# Altium schematic sheet Sheet2.SchDoc
size A2; SheetNumber: 1; SheetTotal: 1
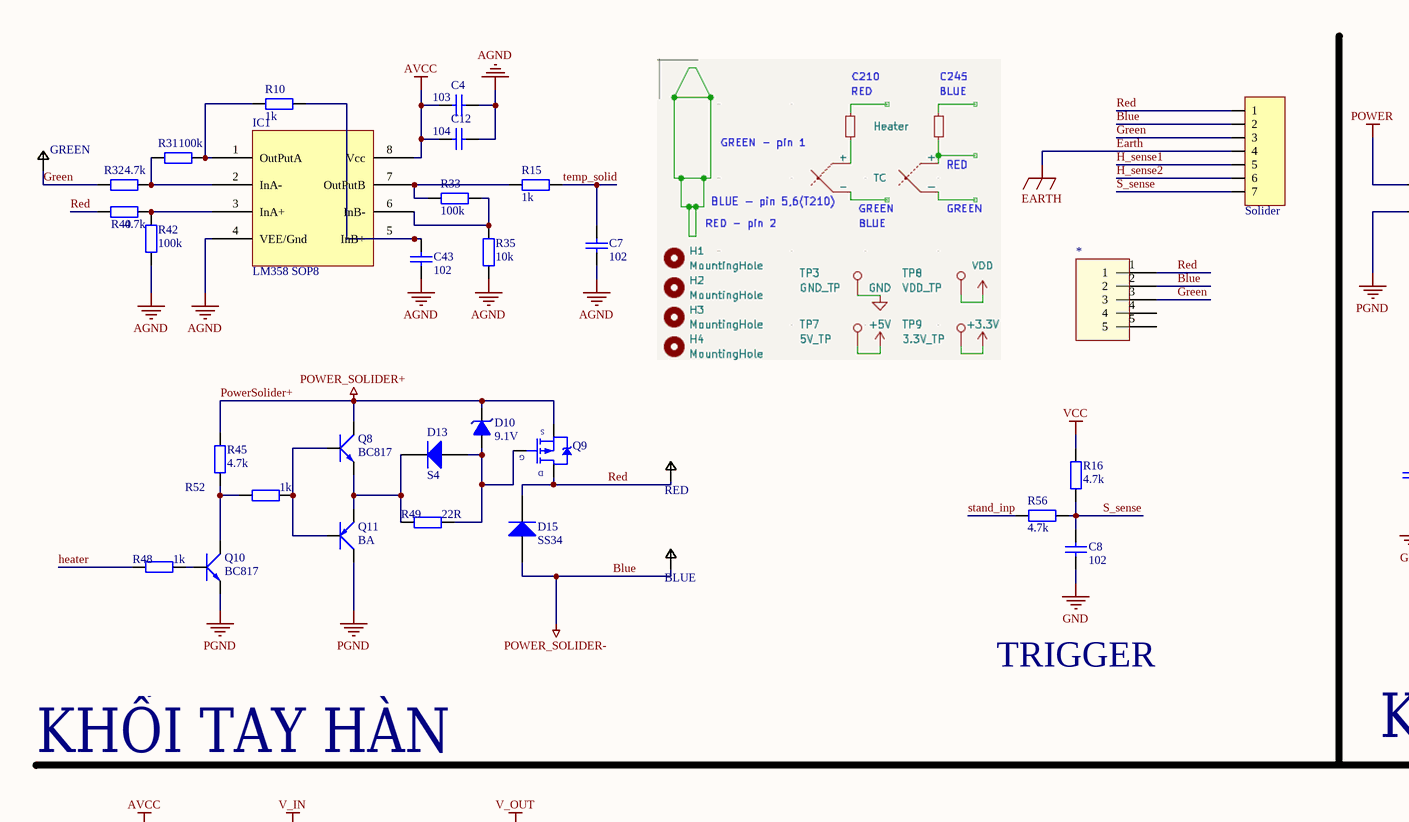
[diagram p0: Sheet2.SchDoc, top left]
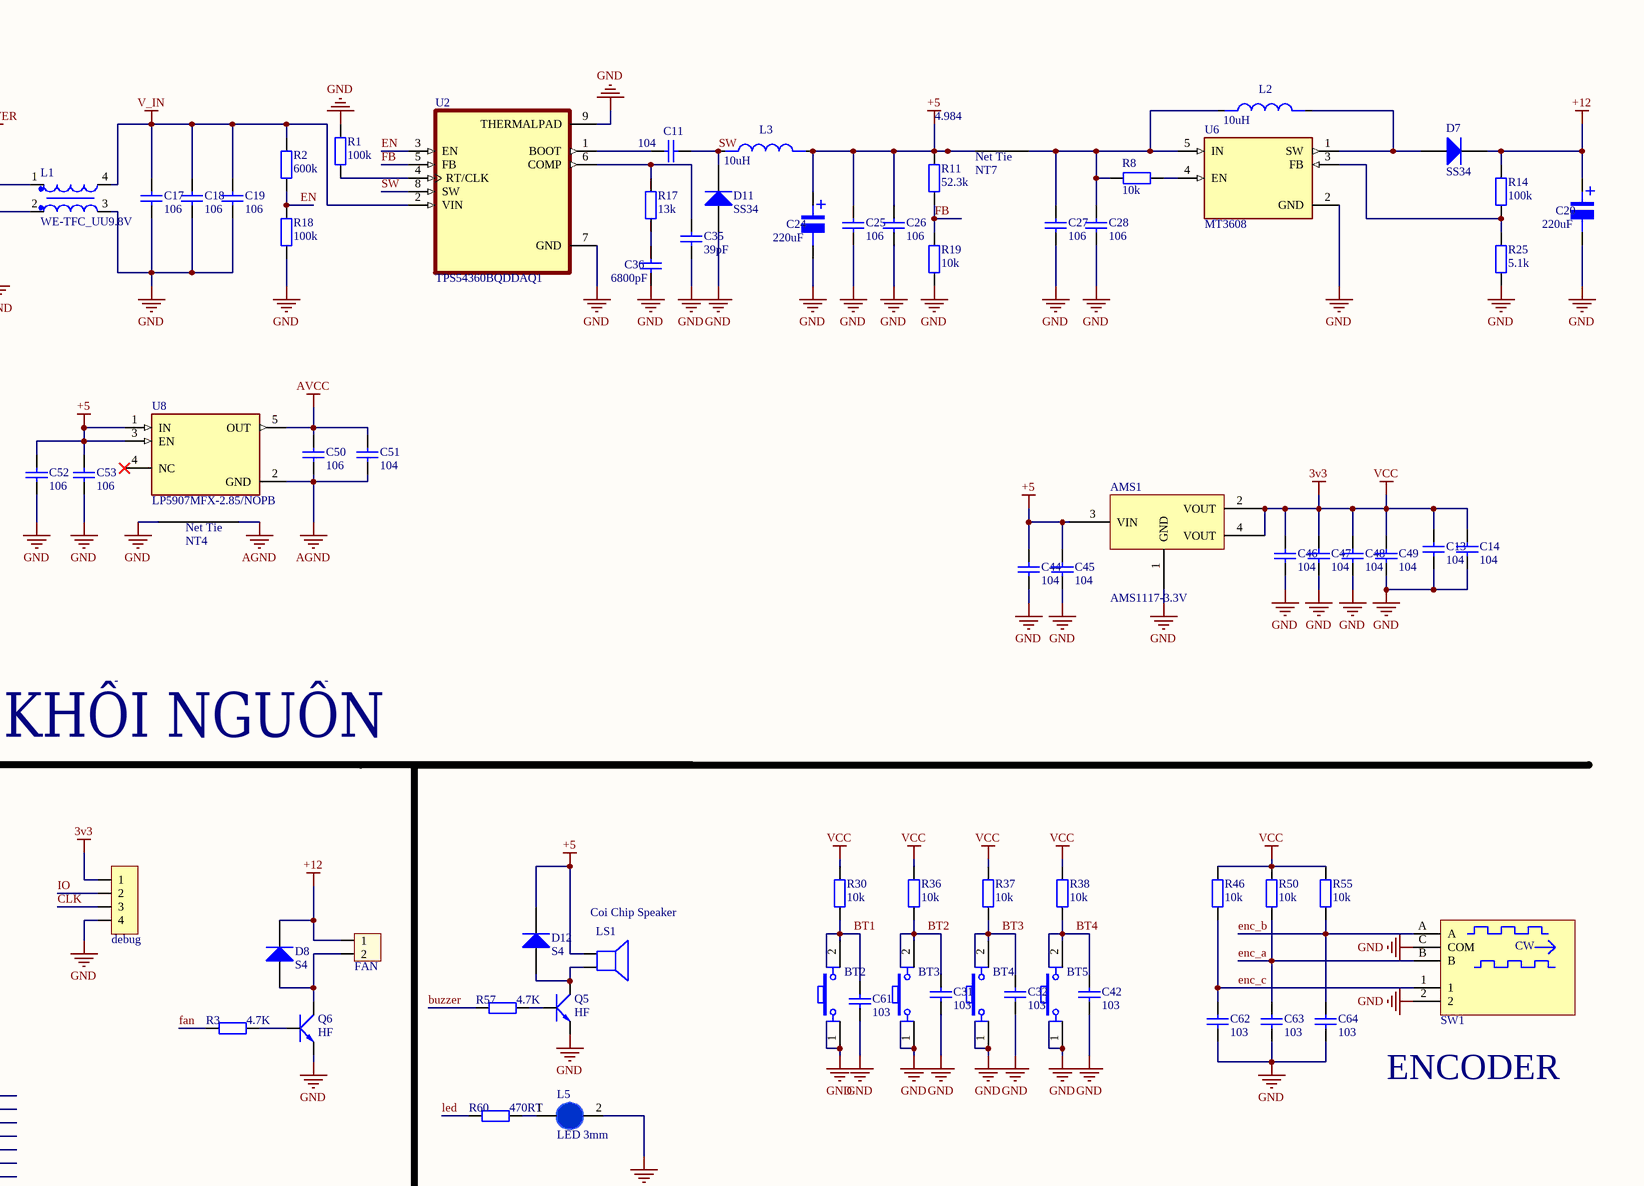
[diagram p1: Sheet2.SchDoc, top right]
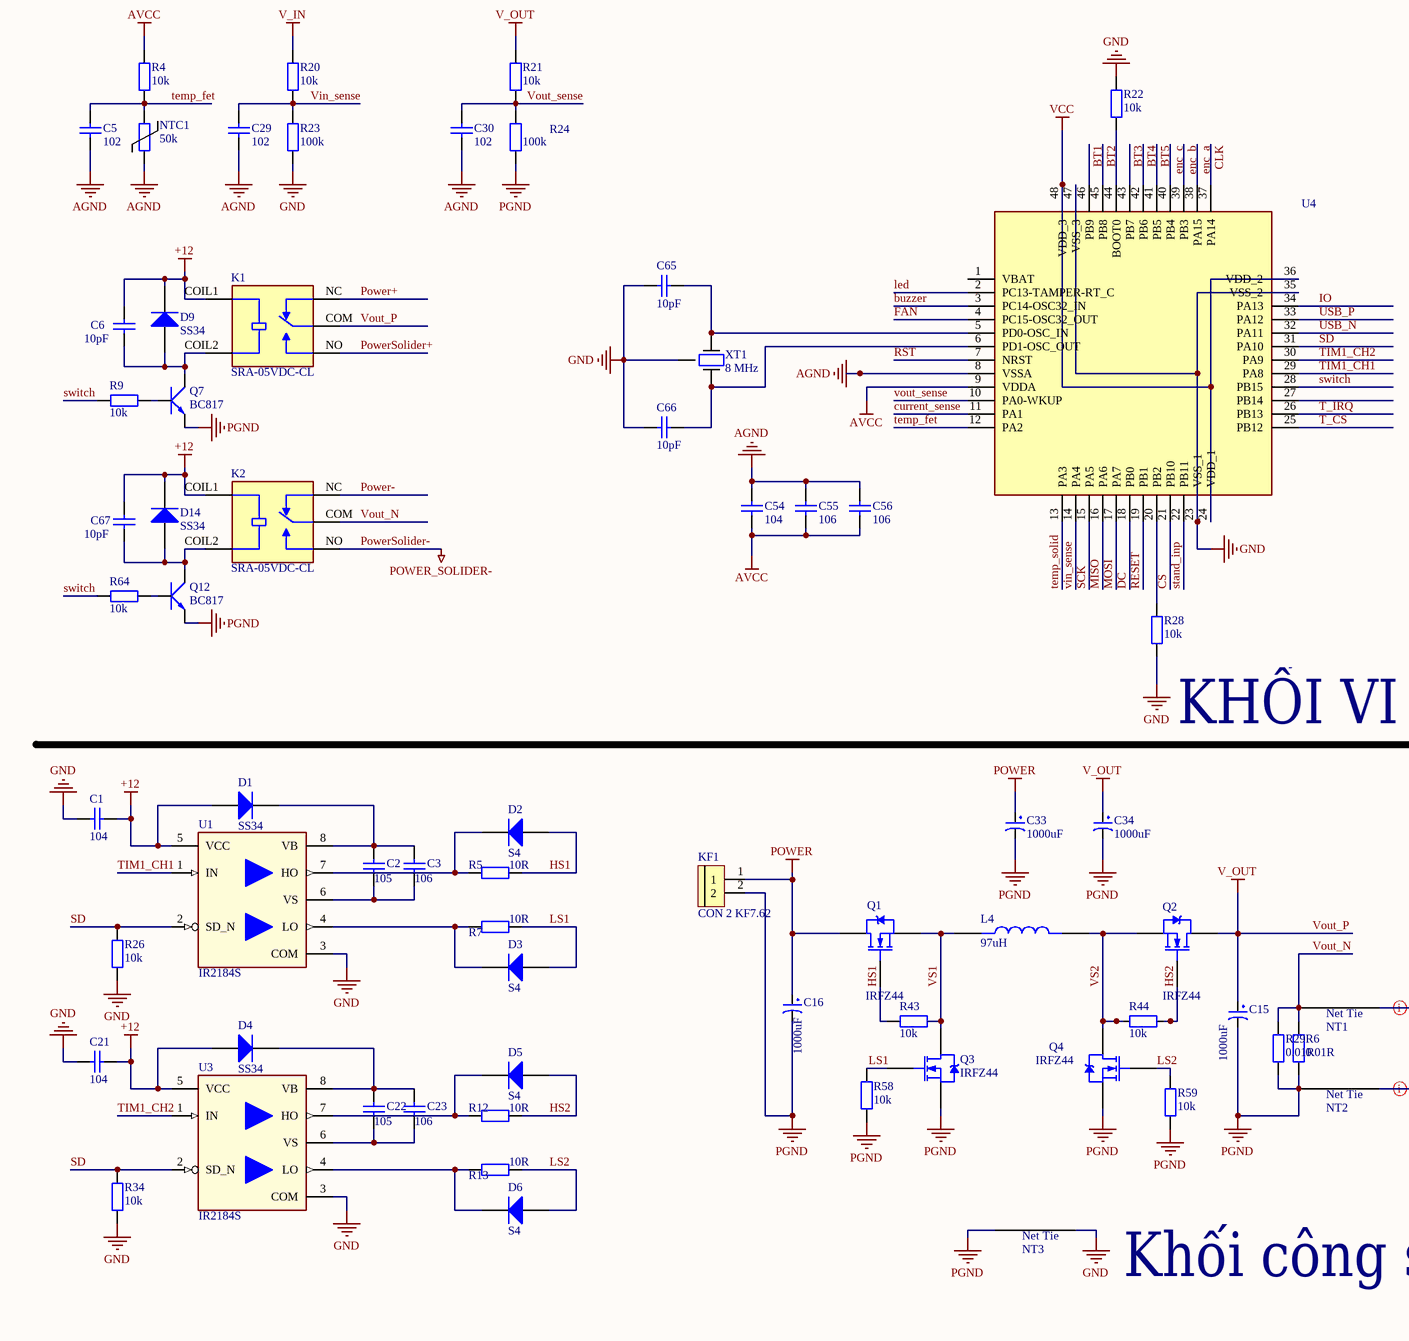
[diagram p2: Sheet2.SchDoc, bottom left]
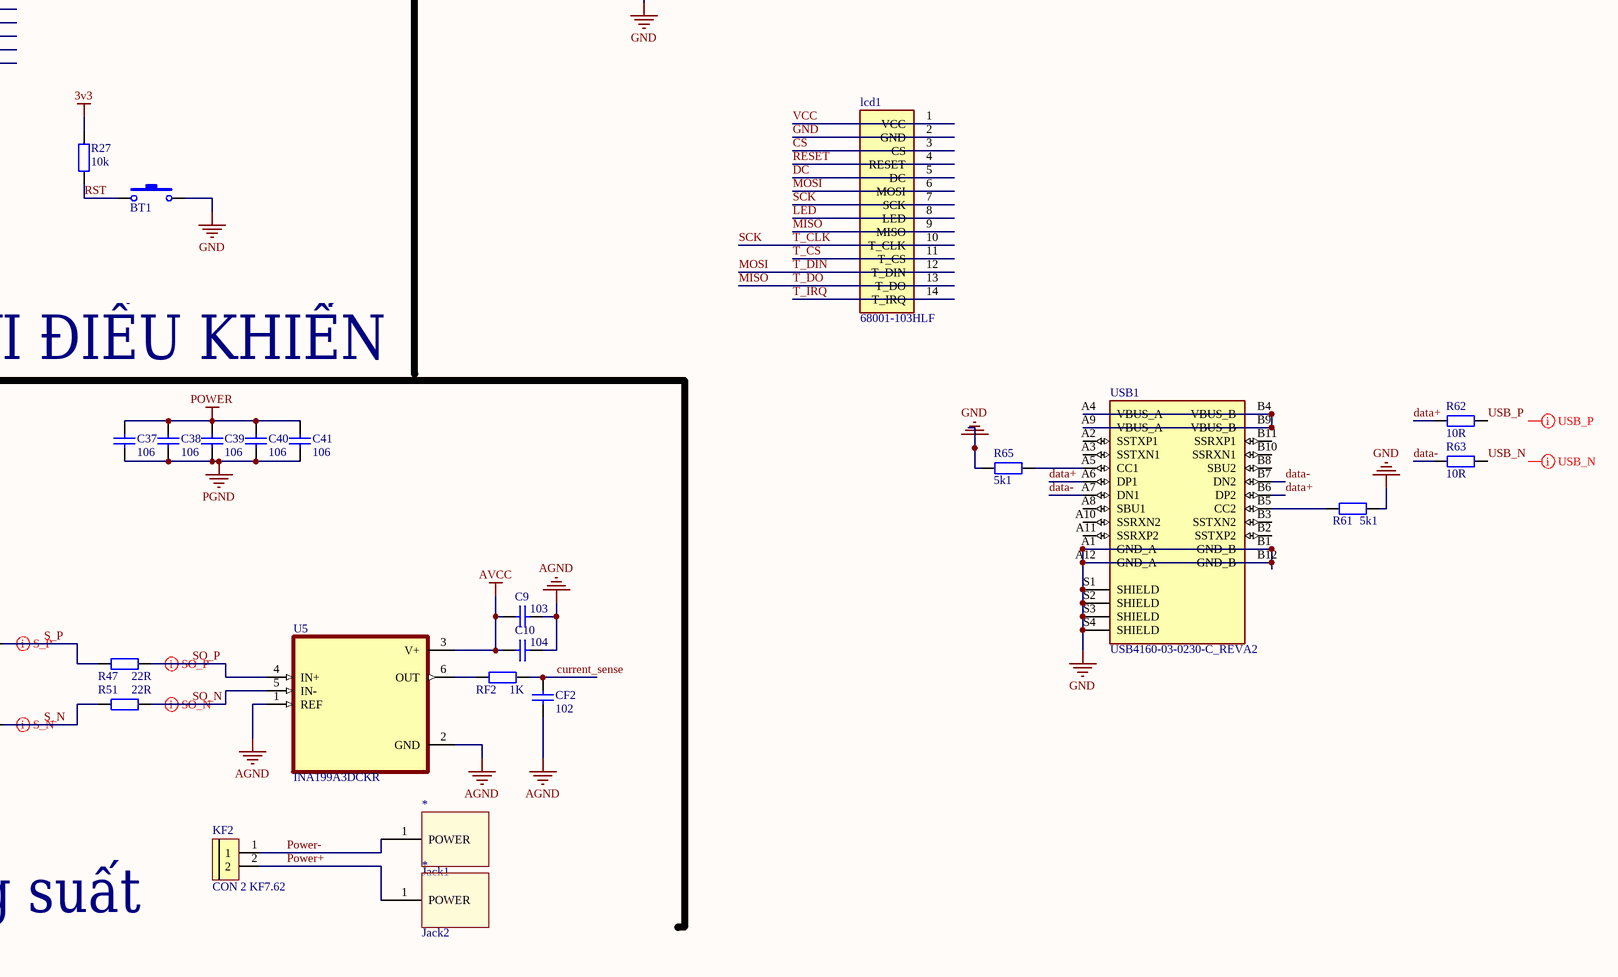
[diagram p3: Sheet2.SchDoc, bottom right]

## Parts
(Parts that share a designator on the sheet are numbered #1, #2 ... from top to bottom, then left to right.)
*#1  Component_1  [GX_12Jack?]  (value not drawn)
*#2  Jack1  [jack_coc_loa]
*#3  Jack2  [jack_coc_loa]
AMS1  AMS1117-3.3V  [SOT223]
BLUE  TestPoin  [TP-60]  (value not drawn)
BT1  Nut Nhan 2 Chan SMD 3x6x2.5  [Nut Nhan 2 Chan SMD 3x6x2.5]  (value not drawn)
BT2  Nut Nhan 4 Chan Cam 6x6  [Nut Nhan 4 Chan Cam 6x6]  (value not drawn)
BT3  Nut Nhan 4 Chan Cam 6x6  [Nut Nhan 4 Chan Cam 6x6]  (value not drawn)
BT4  Nut Nhan 4 Chan Cam 6x6  [Nut Nhan 4 Chan Cam 6x6]  (value not drawn)
BT5  Nut Nhan 4 Chan Cam 6x6  [Nut Nhan 4 Chan Cam 6x6]  (value not drawn)
C1  104  [tu 0603]
C2  105  [tu 0603]
C3  106  [tu 0805]
C4  103  [tu 0603]
C5  102  [tu 0603]
C6  10pF  [tu 0805]
C7  102  [tu 0603]
C8  102  [tu 0603]
C9  103  [tu 0603]
C10  104  [tu 0603]
C11  104  [tu 0603]
C12  104  [tu 0603]
C13  104  [tu 0603]
C14  104  [tu 0603]
C15  1000uF  [tu hoa 10mm]
C16  1000uF  [tu hoa 10mm]
C17  106  [tu 0805]
C18  106  [tu 0805]
C19  106  [tu 0805]
C20  220uF  [tu nhom 6.3 (d)]
C21  104  [tu 0603]
C22  105  [tu 0603]
C23  106  [tu 0805]
C24  220uF  [tu nhom 6.3 (d)]
C25  106  [tu 0805]
C26  106  [tu 0805]
C27  106  [tu 0805]
C28  106  [tu 0805]
C29  102  [tu 0603]
C30  102  [tu 0603]
C31  103  [tu 0603]
C32  103  [tu 0603]
C33  1000uF  [tu hoa 13mm]
C34  1000uF  [tu hoa 13mm]
C35  39pF  [tu 0603]
C36  6800pF  [tu 0603]
C37  106  [tu 0805]
C38  106  [tu 0805]
C39  106  [tu 0805]
C40  106  [tu 0805]
C41  106  [tu 0805]
C42  103  [tu 0603]
C43  102  [tu 0603]
C44  104  [tu 0603]
C45  104  [tu 0603]
C46  104  [tu 0603]
C47  104  [tu 0603]
C48  104  [tu 0603]
C49  104  [tu 0603]
C50  106  [tu 0603]
C51  104  [tu 0603]
C52  106  [tu 0603]
C53  106  [tu 0603]
C54  104  [tu 0603]
C55  106  [tu 0603]
C56  106  [tu 0603]
C61  103  [tu 0603]
C62  103  [tu 0603]
C63  103  [tu 0603]
C64  103  [tu 0603]
C65  10pF  [tu 0603]
C66  10pF  [tu 0603]
C67  10pF  [tu 0805]
CF2  102  [tu 0603]
D1  SS34  [DIODE SMA]
D2  S4  [DIODE SOD-123]
D3  S4  [DIODE SOD-123]
D4  SS34  [DIODE SMA]
D5  S4  [DIODE SOD-123]
D6  S4  [DIODE SOD-123]
D7  SS34  [DIODE SMA]
D8  S4  [DIODE SOD-123]
D9  SS34  [DIODE SMA]
D10  9.1V  [DIODE ZENNER SMD SOD80]
D11  SS34  [DIODE SMA]
D12  S4  [DIODE SOD-123]
D13  S4  [DIODE SOD-123]
D14  SS34  [DIODE SMA]
D15  SS34  [DIODE SMA]
GREEN  TestPoin  [TP-60]  (value not drawn)
H1  FAN  [XH2.54M-2]
IC1  LM358 SOP8  [SOP 8]
JP1  debug  [JP 1x4 DT]
JP5  Solider  [JP 1x7 DT]
K1  SRA-05VDC-CL  [RELAY_SRA-05VDC-CL]
K2  SRA-05VDC-CL  [RELAY_SRA-05VDC-CL]
KF1  CON 2 KF7.62  [CON 2 KF7.62]
KF2  CON 2 KF7.62  [CON 2 KF7.62]
L1  WE-TFC_UU9.8V  [WE-TFC_UU9.8V]
L2  10uH  [CUON CAM SMD 0530]
L3  10uH  [CUON CAM SMD 0530]
L4  97uH  [IND_ATCA-08-750M-V]
L5  LED 3mm  [LED-3MM-BLUE]
lcd1  68001-103HLF  [AMPHENOL_68001-103HLF]
LS1  Coi Chip Speaker  [Coi Chip Speacker]
NT1  0.25mm  [NetTie_0.25mm]  (value not drawn)  (net tie, no BOM)
NT2  0.25mm  [NetTie_0.25mm]  (value not drawn)  (net tie, no BOM)
NT3  NetTie_2mm  [NetTie_2mm]  (value not drawn)  (net tie, no BOM)
NT4  0.25mm  [NetTie_0.25mm]  (value not drawn)  (net tie, no BOM)
NT7  NetTie_2mm  [NetTie_2mm]  (value not drawn)  (net tie, no BOM)
NTC1  50k  [MF52]
Q1  IRFZ44  [TO220]
Q2  IRFZ44  [TO220]
Q3  IRFZ44  [TO220]
Q4  IRFZ44  [TO220]
Q5  HF  [SOT-23]
Q6  HF  [SOT-23]
Q7  BC817  [SOT-23]
Q8  BC817  [SOT-23]
Q9  IRF4905S  [D2PACK]  (value not drawn)
Q10  BC817  [SOT-23]
Q11  BA  [SOT23]
Q12  BC817  [SOT-23]
R1  100k  [tro smd 0603]
R2  600k  [tro smd 0603]
R3  4.7K  [Tro smd 0603]
R4  10k  [tro smd 0603]
R5  10R  [Tro smd 0603]
R6  0.01R  [tro smd 2512]
R7  10R  [Tro smd 0603]
R8  10k  [tro smd 0603]
R9  10k  [Tro smd 0603]
R10  1k  [Tro smd 0603]
R11  52.3k  [tro smd 0603]
R12  10R  [Tro smd 0603]
R13  10R  [Tro smd 0603]
R14  100k  [tro smd 0603]
R15  1k  [Tro smd 0603]
R16  4.7k  [Tro smd 0603]
R17  13k  [tro smd 0603]
R18  100k  [tro smd 0603]
R19  10k  [tro smd 0603]
R20  10k  [tro smd 0603]
R21  10k  [tro smd 0603]
R22  10k  [Tro smd 0603]
R23  100k  [tro smd 0603]
R24  100k  [tro smd 0603]
R25  5.1k  [tro smd 0603]
R26  10k  [Tro smd 0603]
R27  10k  [Tro smd 0603]
R28  10k  [Tro smd 0603]
R29  0.01R  [tro smd 2512]
R30  10k  [Tro smd 0603]
R31  100k  [Tro smd 0603]
R32  4.7k  [Tro smd 0603]
R33  100k  [Tro smd 0603]
R34  10k  [Tro smd 0603]
R35  10k  [Tro smd 0603]
R36  10k  [Tro smd 0603]
R37  10k  [Tro smd 0603]
R38  10k  [Tro smd 0603]
R40  4.7k  [Tro smd 0603]
R42  100k  [Tro smd 0603]
R43  10k  [tro smd 0603]
R44  10k  [tro smd 0603]
R45  4.7k  [Tro smd 0603]
R46  10k  [Tro smd 0603]
R47  22R  [Tro smd 0603]
R48  1k  [Tro smd 0603]
R49  22R  [Tro smd 0603]
R50  10k  [Tro smd 0603]
R51  22R  [Tro smd 0603]
R52  1k  [Tro smd 0603]
R55  10k  [Tro smd 0603]
R56  4.7k  [Tro smd 0603]
R57  4.7K  [Tro smd 0603]
R58  10k  [tro smd 0603]
R59  10k  [tro smd 0603]
R60  470RT  [Tro smd 0603]
R61  5k1  [tro smd 0603]
R62  10R  [Tro smd 0603]
R63  10R  [Tro smd 0603]
R64  10k  [Tro smd 0603]
R65  5k1  [tro smd 0603]
RED  TestPoin  [TP-60]  (value not drawn)
RF2  1K  [Tro smd 0603]
SW1  482024764004  [482024764004]  (value not drawn)
U1  IR2184S  [SOIC127P600X175-8N-12-V]
U2  TPS54360BQDDAQ1  [VREG_LM5017MR/NOPB]
U3  IR2184S  [SOIC127P600X175-8N-12-V]
U4  STM32F103C8T6  [LQFP-48_19.6_393_58X11_SMD]  (value not drawn)
U5  INA199A3DCKR  [SOT65P210X110-6N]
U6  MT3608  [SOT95P280X145-6N]
U8  LP5907MFX-2.85/NOPB  [SOT95P280X145-5N]
USB1  USB4160-03-0230-C_REVA2  [GCT_USB4160-03-0230-C_REVA2]
XT1  8 MHz  [DFN220P320X110-4N]

## Nets
+5: AMS1.3(VIN) C24.1 C25.1 C26.1 C44.1 C45.1 C52.1 C53.1 D12.2(K) L3.2 LS1.1 NT7.1 R11.2 U8.1(IN) U8.3(EN)
+12: C1.2 C6.1 C20.1 C21.2 C67.1 D1.1(A) D4.1(A) D7.2(K) D8.2(K) D9.2(K) D14.2(K) H1.1 K1.COIL1 K2.COIL1 R14.2 U1.5(VCC) U3.5(VCC)
AGND: C4.2 C5.1 C7.1 C9.2 C10.2 C12.2 C29.1 C30.1 C43.1 C50.2 C51.2 C54.2 C55.2 C56.2 CF2.1 IC1.4(VEE/Gnd) NT4.2 NTC1.1 R35.2 R42.2 U4.8(VSSA) U5.1(REF) U5.2(GND) U8.2(GND)
AVCC: C4.1 C9.1 C10.1 C12.1 C50.1 C51.1 C54.1 C55.1 C56.1 IC1.8(Vcc) R4.1 U4.9(VDDA) U5.3(V+) U8.5(OUT)
Blue: *#1.2 BLUE.1 D15.1(A) JP5.2 K2.NO  [also labelled POWER_SOLIDER-, PowerSolider-]
Earth: JP5.4
GND: AMS1.1(GND) BT1.2 BT2.1 BT3.1 BT4.1 BT5.1 C1.1 C8.1 C13.2 C14.2 C17.2 C18.2 C19.2 C20.2 C21.1 C24.2 C25.2 C26.2 C27.2 C28.2 C31.1 C32.1 C35.2 C36.2 C42.1 C44.2 C45.2 C46.2 C47.2 C48.2 C49.2 C52.2 C53.2 C61.1 C62.1 C63.1 C64.1 C65.2 C66.2 D11.1(A) JP1.4 L1.3 L5.2(K) lcd1.2(GND) NT3.2 NT4.1 Q5.2(E) Q6.2(E) R1.1 R18.1 R19.1 R22.2 R23.2 R25.1 R26.1 R28.1 R34.1 R61.2 R65.2 SW1.2 SW1.C(COM) U1.3(COM) U2.7(GND) U2.9(THERMALPAD) U3.3(COM) U4.23(VSS_1) U4.35(VSS_2) U4.47(VSS_3) U6.2(GND) USB1.A1(GND_A) USB1.A12(GND_A) USB1.B1(GND_B) USB1.B12(GND_B) USB1.S1(SHIELD) USB1.S2(SHIELD) USB1.S3(SHIELD) USB1.S4(SHIELD) XT1.G
PGND: C15.2 C16.2 C33.2 C34.2 C37.2 C38.2 C39.2 C40.2 C41.2 KF1.2 L1.2 NT2.1 NT3.1 Q3.3(S) Q4.3(S) Q7.2(E) Q10.2(E) Q11.3(C) Q12.2(E) R6.1 R24.2 R29.1 R58.2 R59.2
POWER: C16.1 C33.1 C37.1 C38.1 C39.1 C40.1 C41.1 KF1.1 L1.1 Q1.2(D)
PowerSolider+: D10.2(K) K1.NO Q8.3(C) Q9.3(S) R45.2  [also labelled POWER_SOLIDER+]
V_IN: C17.1 C18.1 C19.1 L1.4 R2.2 R20.1 U2.2(VIN)
VCC: AMS1.2(VOUT) AMS1.4(VOUT) C13.1 C14.1 C46.1 C47.1 C48.1 C49.1 JP1.1 lcd1.1(VCC) R16.2 R27.2 R30.2 R36.2 R37.2 R38.2 R46.2 R50.2 R55.2 U4.24(VDD_1) U4.36(VDD_2) U4.48(VDD_3)  [also labelled 3v3]
Vout_P: C15.1 C34.1 K1.COM Q2.2(D) R21.1  [also labelled V_OUT]
BT1: BT2.2 C61.2 R30.1 U4.46(PB9)
BT2: BT3.2 C31.2 R36.1 U4.45(PB8)
BT3: BT4.2 C32.2 R37.1 U4.43(PB7)
BT4: BT5.2 C42.2 R38.1 U4.42(PB6)
BT5: U4.41(PB5)
buzzer: R57.1 U4.3(PC14-OSC32_IN)
CLK: JP1.3 U4.37(PA14)
CS: lcd1.3(CS) U4.21(PB10)
current_sense: CF2.2 RF2.2 U4.11(PA1)
data+: R62.1 USB1.A6(DP1) USB1.B6(DP2)
data-: R63.1 USB1.A7(DN1) USB1.B7(DN2)
DC: lcd1.5(DC) U4.18(PB0)
EN: R2.1 R18.2 U2.3(EN)
enc_a: C63.2 R50.1 SW1.B U4.38(PA15)
enc_b: C64.2 R55.1 SW1.A U4.39(PB3)
enc_c: C62.2 R46.1 SW1.1 U4.40(PB4)
FAN: R3.1 U4.4(PC15-OSC32_OUT)
FB: R11.1 R19.2 U2.5(FB)
Green: *#1.3 GREEN.1 JP5.3 R32.2
H_sense1: JP5.5
H_sense2: JP5.6
heater: R48.1
HS1: D2.1(A) Q1.1(G) R5.2 R43.1
HS2: D5.1(A) Q2.1(G) R12.2 R44.2
IO: JP1.2 U4.34(PA13)
led: lcd1.8(LED) R60.1 U4.2(PC13-TAMPER-RT_C)
LS1: D3.1(A) Q3.1(G) R7.2 R58.1
LS2: D6.1(A) Q4.1(G) R13.2 R59.1
MISO: lcd1.9(MISO) lcd1.13(T_DO) U4.16(PA6)  [also labelled T_DO]
MOSI: lcd1.6(MOSI) lcd1.12(T_DIN) U4.17(PA7)  [also labelled T_DIN]
Power+: *#3.1(POWER) K1.NC KF2.2
Power-: *#2.1(POWER) K2.NC KF2.1
Red: *#1.1 D15.2(K) JP5.1 Q9.2(D) R40.2 RED.1
RESET: lcd1.4(RESET) U4.19(PB1)
RST: BT1.1 R27.1 U4.7(NRST)
S_N: NT2.2 R51.1
S_P: NT1.2 R47.1
S_sense: C8.2 JP5.7 R16.1 R56.1
SCK: lcd1.7(SCK) lcd1.10(T_CLK) U4.15(PA5)  [also labelled T_CLK]
SD: R26.2 R34.2 U1.2(SD_N) U3.2(SD_N) U4.31(PA10)
SO_N: R51.2 U5.5(IN-)
SO_P: R47.2 U5.4(IN+)
stand_inp: R56.2 U4.22(PB11)
SW: C11.2 D11.2(K) L3.1 U2.8(SW)
switch: R9.2 R64.2 U4.28(PB15)
T_CS: lcd1.11(T_CS) U4.25(PB12)
T_IRQ: lcd1.14(T_IRQ) U4.26(PB13)
temp_fet: C5.2 NTC1.2 R4.2 U4.12(PA2)
temp_solid: C7.2 R15.2 U4.13(PA3)
TIM1_CH1: U1.1(IN) U4.29(PA8)
TIM1_CH2: U3.1(IN) U4.30(PA9)
USB_N: R63.2 U4.32(PA11)
USB_P: R62.2 U4.33(PA12)
Vin_sense: C29.2 R20.2 R23.1 U4.14(PA4)
Vout_N: K2.COM NT1.1 R6.2 R29.2
Vout_sense: C30.2 R21.2 R24.1 U4.10(PA0-WKUP)
VS1: L4.1 Q1.3(S) Q3.2(D) R43.2
VS2: L4.2 Q2.3(S) Q4.2(D) R44.1
NetC2_1: C2.1 C3.2 U1.6(VS)
NetC2_2: C2.2 C3.1 D1.2(K) U1.8(VB)
NetC6_2: C6.2 D9.1(A) K1.COIL2 Q7.3(C)
NetC11_1: C11.1 U2.1(BOOT)
NetC22_1: C22.1 C23.2 U3.6(VS)
NetC22_2: C22.2 C23.1 D4.2(K) U3.8(VB)
NetC27_1: C27.1 C28.1 L2.1 NT7.2 R8.2 U6.5(IN)
NetC35_1: C35.1 R17.1 U2.6(COMP)
NetC36_1: C36.1 R17.2
NetC43_2: C43.2 IC1.5(InB+) R10.1
NetC65_1: C65.1 U4.5(PD0-OSC_IN) XT1.1
NetC66_1: C66.1 U4.6(PD1-OSC_OUT) XT1.3
NetC67_2: C67.2 D14.1(A) K2.COIL2 Q12.3(C)
NetD2_2: D2.2(K) R5.1 U1.7(HO)
NetD3_2: D3.2(K) R7.1 U1.4(LO)
NetD5_2: D5.2(K) R12.1 U3.7(HO)
NetD6_2: D6.2(K) R13.1 U3.4(LO)
NetD7_1: D7.1(A) L2.2 U6.1(SW)
NetD8_1: D8.1(A) H1.2 Q6.3(C)
NetD10_1: D10.1(A) D13.1(A) Q9.1(G) R49.2
NetD12_1: D12.1(A) LS1.2 Q5.3(C)
NetD13_2: D13.2(K) Q8.2(E) Q11.2(E) R49.1
NetIC1_1: IC1.1(OutPutA) R10.2 R31.2
NetIC1_2: IC1.2(InA-) R31.1 R32.1
NetIC1_3: IC1.3(InA+) R40.1 R42.1
NetIC1_6: IC1.6(InB-) R33.2 R35.1
NetIC1_7: IC1.7(OutPutB) R15.1 R33.1
NetL5_1: L5.1(A) R60.2
NetQ5_1: Q5.1(B) R57.2
NetQ6_1: Q6.1(B) R3.2
NetQ7_1: Q7.1(B) R9.1
NetQ8_1: Q8.1(B) Q11.1(B) R52.2
NetQ10_1: Q10.1(B) R48.2
NetQ10_3: Q10.3(C) R45.1 R52.1
NetQ12_1: Q12.1(B) R64.1
NetR1_2: R1.2 U2.4(RT/CLK)
NetR8_1: R8.1 U6.4(EN)
NetR14_1: R14.1 R25.2 U6.3(FB)
NetR22_1: R22.1 U4.44(BOOT0)
NetR28_2: R28.2 U4.20(PB2)
NetR61_1: R61.1 USB1.B5(CC2)
NetR65_1: R65.1 USB1.A5(CC1)
NetRF2_1: RF2.1 U5.6(OUT)
NetUSB1_A4: USB1.A4(VBUS_A) USB1.A9(VBUS_A) USB1.B4(VBUS_B) USB1.B9(VBUS_B)

Not connected (* = marked no-connect by the designer): *#1 4 5; U4 1(VBAT) 27(PB14); U8 4(NC)*; USB1 A2(SSTXP1) A3(SSTXN1) A8(SBU1) A10(SSRXN2) A11(SSRXP2) B2(SSTXP2) B3(SSTXN2) B8(SBU2) B10(SSRXN1) B11(SSRXP1)

## Layout directives
differential pair: (no net found under the mark), S_N, S_P, SO_N, SO_P

## Notes on the sheet
- 4.984
- TRIGGER
- KHỐI TAY HÀN
- KHỐI NGUỒN
- ENCODER
- (near R28) KHỐI VI ĐIỀU KHIỂN
- Khối công suất
- (in symbol 482024764004) CW
- (in symbol NetTie_0.25mm) Net Tie
- (in symbol NetTie_2mm) Net Tie
- (in symbol Tu Nhom 220uF 16V) +

## Library data of the parts
*#2 *#3 = Jack?
AMS1 = AMS1117 SMD: Dán; Value: AMS1117-3.3V SOT223; Don_Vi: Con; Ma_Hang: MH000596; Ghi_Chu: *; Kieu_Chan: *; Chung_Loai: Dán
BT1 = Nut Nhan 2 Chan SMD 3x6x2.5: Ma_Hang: MH001036; Ten: Nút Nhấn 2 Chân 3x6x2.5MM SMD
BT2-BT5 = Nut Nhan 4 Chan Cam 6x6: Nut Nhan 4 Chan 6x6mm; Ten: Nút Nhấn 4 Chân 6x6x5MM DIP; Ma_Hang: MH004584
C1 C2 C13 C14 C21 C22 C44-C49 = Tu 0603 101 50V 10%: Dán; Don_Vi: Con; So_Chan: 2; Ten_Linh_Kien: Tụ 0603 101-0.1nF 10% 50V; Ma_Hang: MH004565; Chung_Loai: Dán; Kieu_Chan: *
C3 C6 C23 C67 = Tu 0805 101 50V 20%: Dán; Don_Vi: Con; So_Chan: 2; Ten_Linh_Kien: Tụ 0805 101-0.1nF 50V 20%; Ma_Hang: MH002806; Chung_Loai: Dán; Kieu_Chan: *
C4 C7-C10 C12 C31 C32 C35 C36 C42 C43 C50-C56 C61-C64 CF2 = Tu 0603 106 16V 20%: Dán; Don_Vi: Con; So_Chan: 2; Ten_Linh_Kien: Tụ 0603-10uF 20% 16V; Ma_Hang: MH004848; Chung_Loai: Dán; Kieu_Chan: *
C5 C11 C29 C30 C65 C66 = Tu 0603 104 50V 10%: Dán; Don_Vi: Con; So_Chan: 2; Ten_Linh_Kien: Tụ 0603 104-100nF 10% 50V; Ma_Hang: MH004568; Chung_Loai: Dán; Kieu_Chan: *
C15 C16 = Tu Hoa 1000uF 10V 10x12: Cắm; So_Chan: 2; Don_Vi: Con; Ten_Linh_Kien: Tụ Hóa 1000uF 10V 10x12MM; Ma_Hang: MH006614; Kieu_Chan: *; Chung_Loai: Cắm
C17-C19 C25-C28 C37-C41 = Tu 0805 106 16V 10%: Dán; Ten_Linh_Kien: Tụ 0805 106-10uF 10% 16V; So_Chan: 2; Don_Vi: Con; Ma_Hang: MH004553; Chung_Loai: Dán; Kieu_Chan: *
C20 C24 = Tu Nhom 220uF 16V: Dán; Don_Vi: Con; So_Chan: 2; Ten_Linh_Kien: Tụ Nhôm 220uF 16V 6.3x7.7MM; Ma_Hang: MH002227; Chung_Loai: Dán; Kieu_Chan: *
C33 C34 = Tu Hoa 1000uF 50V 13x26: Cắm; Don_Vi: Con; So_Chan: 2; Ten_Linh_Kien: Tụ Hóa 1000uF 50V; Ma_Hang: MH006619; Chung_Loai: Cắm; Kieu_Chan: *
D1 D4 D7 D9 D11 D14 D15 = Diode SS34 ( 1N5822 ): Dán; Don_Vi: Con; Ma_Hang: MH002104; Ten_Linh_Kien: Diode SS34 3A 40V SMA ( 1N5822 SS34A); Kieu_Chan: *; Chung_Loai: Dán
D2 D3 D5 D6 D8 D12 D13 = Diode S4: Dán; Ten_Linh_Kien: Diode S4 SOD123 ( 1N5819 SOD123); Ma_Hang: MH005519; Don_Vi: Con; Ghi_Chu: *; Chung_Loai: Dán; Kieu_Chan: *
D10 = Diode Zener 9.1V: Dán; Don_Vi: Con; Ma_Hang: MH002882; Ten_Linh_Kien: Diode Zener 1/2W 9.1V SMD1206 ZMM9.1; Ghi_Chu: *; Chung_Loai: Dán; Kieu_Chan: *
H1 = Header 2P 2.54 Duc Thang: Cắm; Ten_Linh_Kien: Header 2P XH2.54-2P Đực Thẳng; Don_Vi: Con; Ma_Hang: MH001283; Chung_Loai: Cắm
IC1 = LM358 SOP8: Dán; Ma_Hang: MH000609; Don_Vi: Con; Ten_Linh_Kien: LM358 SOP8; Kieu_Chan: *; Ghi_Chu: *; Chung_Loai: Dán
JP1 = JP 1x4 2.54 Duc Thang: Cắm; Ten_Linh_Kien: Jump Đơn Đực 2.54MM 1x40P Thẳng 11MM; Don_Vi: Con; Ma_Hang: MH000903; Ghi_Chu: *; Kieu_Chan: *; Chung_Loai: Cắm
JP5 = JP 1x7 2.54 Duc Thang: Cắm; Ten_Linh_Kien: Jump Đơn Đực 2.54MM 1x40P Thẳng 11MM; Don_Vi: Con; Ma_Hang: MH000903; Ghi_Chu: *; Kieu_Chan: *; Chung_Loai: Cắm
K1 K2 = SRA-05VDC-CL: MF: Songle Relay; SnapEDA_Link: https://www.snapeda.com/parts/SRA-05VDC-CL/Songle+Relay/view-part/?ref=snap; Package: Package; Value: *; MP: SRA-05VDC-CL; Check_prices: https://www.snapeda.com/parts/SRA-05VDC-CL/Songle+Relay/view-part/?ref=eda
KF1 KF2 = CON 2 KF7.62: Cắm; Ma_Hang: MH002053; Ten_Linh_Kien: CON 2 KF7.62-2P 7.62MM (Đen Thẳng); Chung_Loai: Cắm; Ghi_Chu: *; Kieu_Chan: *; Don_Vi: Con
L1 = WE-TFC_UU9.8V: Size Typ UU; L = 25 mH; IR = 0.25 A; RDC = 3.6 â„¦; MF: Wurth Electronics; MP: 744862250; SnapEDA_Link: https://www.snapeda.com/parts/744862250/Wurth+Electronics/view-part/?ref=snap; Package: Vertical-4 Wurth Electronics; Value: *; Check_prices: https://www.snapeda.com/parts/744862250/Wurth+Electronics/view-part/?ref=eda
L2 L3 = Cuon Cam SMD 0530: SMD 0530; MP: FDV0530-H-1R5M=P3; Package: None; Price: None; Value: *; Availability: Unavailable
L4 = ATCA-08-750M-V: Value: *; MP: ATCA-08-750M-V; Package: None; Availability: Unavailable; Price: None
L5 = LED 3mm Xanh Duong: Cắm; Don_Vi: Con; Ma_Hang: MH009003; Ten_Linh_Kien: LED 3MM Xanh Dương SS (1000c); Ghi_Chu: *; Kieu_Chan: *; Chung_Loai: Cắm
lcd1 = 68001-103HLF: Conn Rect UnshroudedHdr 3Cnts ThruHole BergStik 2.54mmPin-Spng Vert 1-Row | Amphenol FCI (Amphenol CS) 68001-103HLF; SnapEDA_Link: https://www.snapeda.com/parts/68001-103HLF/Amphenol/view-part/?ref=snap; Package: None; Value: *; MF: Amphenol; MP: 68001-103HLF; Check_prices: https://www.snapeda.com/parts/68001-103HLF/Amphenol/view-part/?ref=eda
LS1 = Coi Chip Speaker: Còi chip
NT1 NT2 NT4 = NetTie_0.25mm
NTC1 = NCP15XH103F03RC: THERMISTOR 10K OHM NTC 0402 SMD
Q1-Q4 = FET IRFZ44 DIP: TO-220
Q5 Q6 = Trans C1815 HF SMD: SOT-23; Value: C9014
Q7 Q8 Q10 Q12 = Trans BC817: SOT-23 - C8658; Value: C9014
Q9 = IRF4905S: 55V 75A
Q11 = Trans A1015 BA SMD: PNP 600mW, ECB
R1 R2 R8 R11 R14 R17-R19 R25 R43 R44 R58 R59 = Tro 0603 1% 0R: Dán; Don_Vi: Con; So_Chan: 2; Ten_Linh_Kien: Trở 0603 1% 0R; Ma_Hang: MH005792; Chung_Loai: Dán; Kieu_Chan: *
R3 R5 R7 R9 R10 R12 R13 R15 R16 R22 R26-R28 R30-R38 R40 R42 R45-R52 R55-R57 R60 R62-R64 RF2 = Tro 0603 5% 10R: Dán; So_Chan: 2; Ten_Linh_Kien: Trở 0603 5% 10R; Ma_Hang: MH006317; Don_Vi: Con; Chung_Loai: Dán; Kieu_Chan: *
R4 R20 R21 R23 R24 = Tro 0603 5% 10k: Dán; Don_Vi: Con; So_Chan: 2; Ten_Linh_Kien: Trở 0603 5% 10k; Ma_Hang: MH006316; Chung_Loai: Dán; Kieu_Chan: *
R6 R29 = Tro 2512 1% 0.01R: Dán; Don_Vi: Con; So_Chan: 2; Ten_Linh_Kien: Trở 2512 1% R010-0.01R 1W; Ma_Hang: MH004912; Chung_Loai: Dán; Kieu_Chan: *
R61 R65 = Tro 0603 5% 51k: Dán; Don_Vi: Con; So_Chan: 2; Ten_Linh_Kien: Trở 0603 5% 51k; Ma_Hang: MH007666; Chung_Loai: Dán; Kieu_Chan: *
SW1 = 482024764004: WS-ENTV Mechanical Incremental Encoder Switch, Plastic Shaft without bushing, 24Pulse/360°, 24positi; Manufacturer: Wurth Elektronik; Operation Force: 300g; Detent: 24positions; Electrical Life Encoder: 30000Cycles; Electrical Life Switch: 20000Cycles; Insulation Resistance: 100MΩ; Rated Current: 10mA; ComponentLink1Description: Website Link; ComponentLink1URL: https://www.we-online.com/redexpert/article/482024764004?ad; ComponentLink2Description: Datasheet Link; ComponentLink2URL: https://www.we-online.com/redexpert/spec/482024764004?ad; Manufacturer Part Number: 482024764004; Category: Encoder Switches; Match Code: WS-ENTV; Mount: Through Hole; Operating Temperature Max: 85°C; Operating Temperature Min: -40°C; Packaging: Tray; Length: 13.2mm; Width: 12.4mm; Height: 20mm; Resolution: 24Pulse/360°
U1 U3 = IR2184S: Half-Bridge Driver; Manufacturer: Infineon Technologies; Manufacturer Order Number: IR2184S; PackageReference: PG-DSO-8-910
U2 = TPS54360BQDDAQ1: Automotive, 60V Input, 3.5A, Step-Down DC-DC Converter With Eco-mode&trade; 8-SO PowerPAD -40 to 125; MF: Texas Instruments; Purchase-URL: https://pricing.snapeda.com/search/part/TPS54360BQDDAQ1/?ref=eda; Value: *; SnapEDA_Link: https://www.snapeda.com/parts/TPS54360BQDDAQ1/Texas%20Instruments/view-part/1129741/?ref=snap; Package: HSOIC-8 Texas Instruments; MP: TPS54360BQDDAQ1; Check_prices: https://www.snapeda.com/parts/TPS54360BQDDAQ1/Texas%20Instruments/view-part/1129741/?ref=eda; Price: None; Availability: Bad
U4 = IC_STM32F103C8T6: ARM® Cortex®-M3 STM32F1 Microcontroller IC 32-Bit 72MHz 64KB (64K x 8) FLASH 48-LQFP (7x7); Manufacturer: STMicroelectronics; Alternate Part Number-1: NA; Manufacturer Part Number: STM32F103C8T6; Case/Package: LQFP48; Supplier-1: LCSC; Supplier Part Number-1: STM32F103C8T6
U5 = INA199A3DCKR: 26V, bi-directional current sense amplifier; MF: Texas Instruments; SnapEDA_Link: https://www.snapeda.com/parts/INA199A3DCKR/Texas+Instruments/view-part/?ref=snap; Package: SOT-SC70-6 Texas Instruments; Value: *; MP: INA199A3DCKR; Check_prices: https://www.snapeda.com/parts/INA199A3DCKR/Texas+Instruments/view-part/?ref=eda
U6 = MT3608: High Efficiency 1.2MHz2A Step Up Converter; MF: Aerosemi Technology Co., Ltd; Price: None; Availability: Not in stock; Package: Package; MP: MT3608; Value: *; SnapEDA_Link: https://www.snapeda.com/parts/MT3608/Aerosemi+Technology+Co.%252C+Ltd/view-part/?ref=snap; Check_prices: https://www.snapeda.com/parts/MT3608/Aerosemi+Technology+Co.%252C+Ltd/view-part/?ref=eda
U8 = LP5907MFX-2.85/NOPB: 250-mA, low-noise, high-PSRR, ultra-low-dropout voltage regulator with low IQ and enable; MF: Texas Instruments; SnapEDA_Link: https://www.snapeda.com/parts/LP5907MFX-2.85/NOPB/Texas+Instruments/view-part/?ref=snap; Package: SOT-23-5 Texas Instruments; Value: *; MP: LP5907MFX-2.85/NOPB; Check_prices: https://www.snapeda.com/parts/LP5907MFX-2.85/NOPB/Texas+Instruments/view-part/?ref=eda
XT1 = ABM3B-8.000MHZ-10-1-U-T: Crystal 8MHz ±10ppm 10pF 200 Ohm -10°C ~ 60°C Surface Mount 4-SMD, No Lead (DFN, LCC); Manufacturer: Abracon LLC; Operating Mode: Fundamental; Value: 8 MHz; Supplier 1: Digi-Key; Supplier Part Number 1: 535-9721-1-ND; RoHS: RoHS Compliant; Category: Crystals, Oscillators, Resonators; Stock: 35437; Pricing 1: 1=0.69, 10=0.578, 50=0.5198, 100=0.462, 500=0.4389 (USD); Packaging: Cut Tape (CT); Part Status: Active; Type: MHz Crystal; Frequency Stability: ±10ppm; Frequency Tolerance: ±10ppm; Load Capacitance: 10pF; Operating Temperature: -10°C ~ 60°C; Ratings: -; Mounting Type: Surface Mount; Package / Case: 4-SMD, No Lead; Size / Dimension: 0.197" L x 0.126" W (5.00mm x 3.20mm); Height - Seated (Max): 0.043" (1.10mm); ComponentLink1URL: http://www.abracon.com/Resonators/abm3b.pdf; ComponentLink1Description: http://www.abracon.com/Resonators/abm3b.pdf; Supplier 2: Digi-Key; Supplier Part Number 2: 535-9721-2-ND; Pricing 2: 1000=0.336, 3000=0.315, 5000=0.3045, 10000=0.294 (USD); Manufacturer Part Number: ABM3B-8.000MHZ-10-1-U-T
USB1 = USB4160-03-0230-C_REVA2: Price: None; Value: *; Package: None; Availability: Unavailable; MP: USB4160-03-0230-C_REVA2